# EAGLE design BMS Segment Jeff v2 (EAGLE 8.1.0)
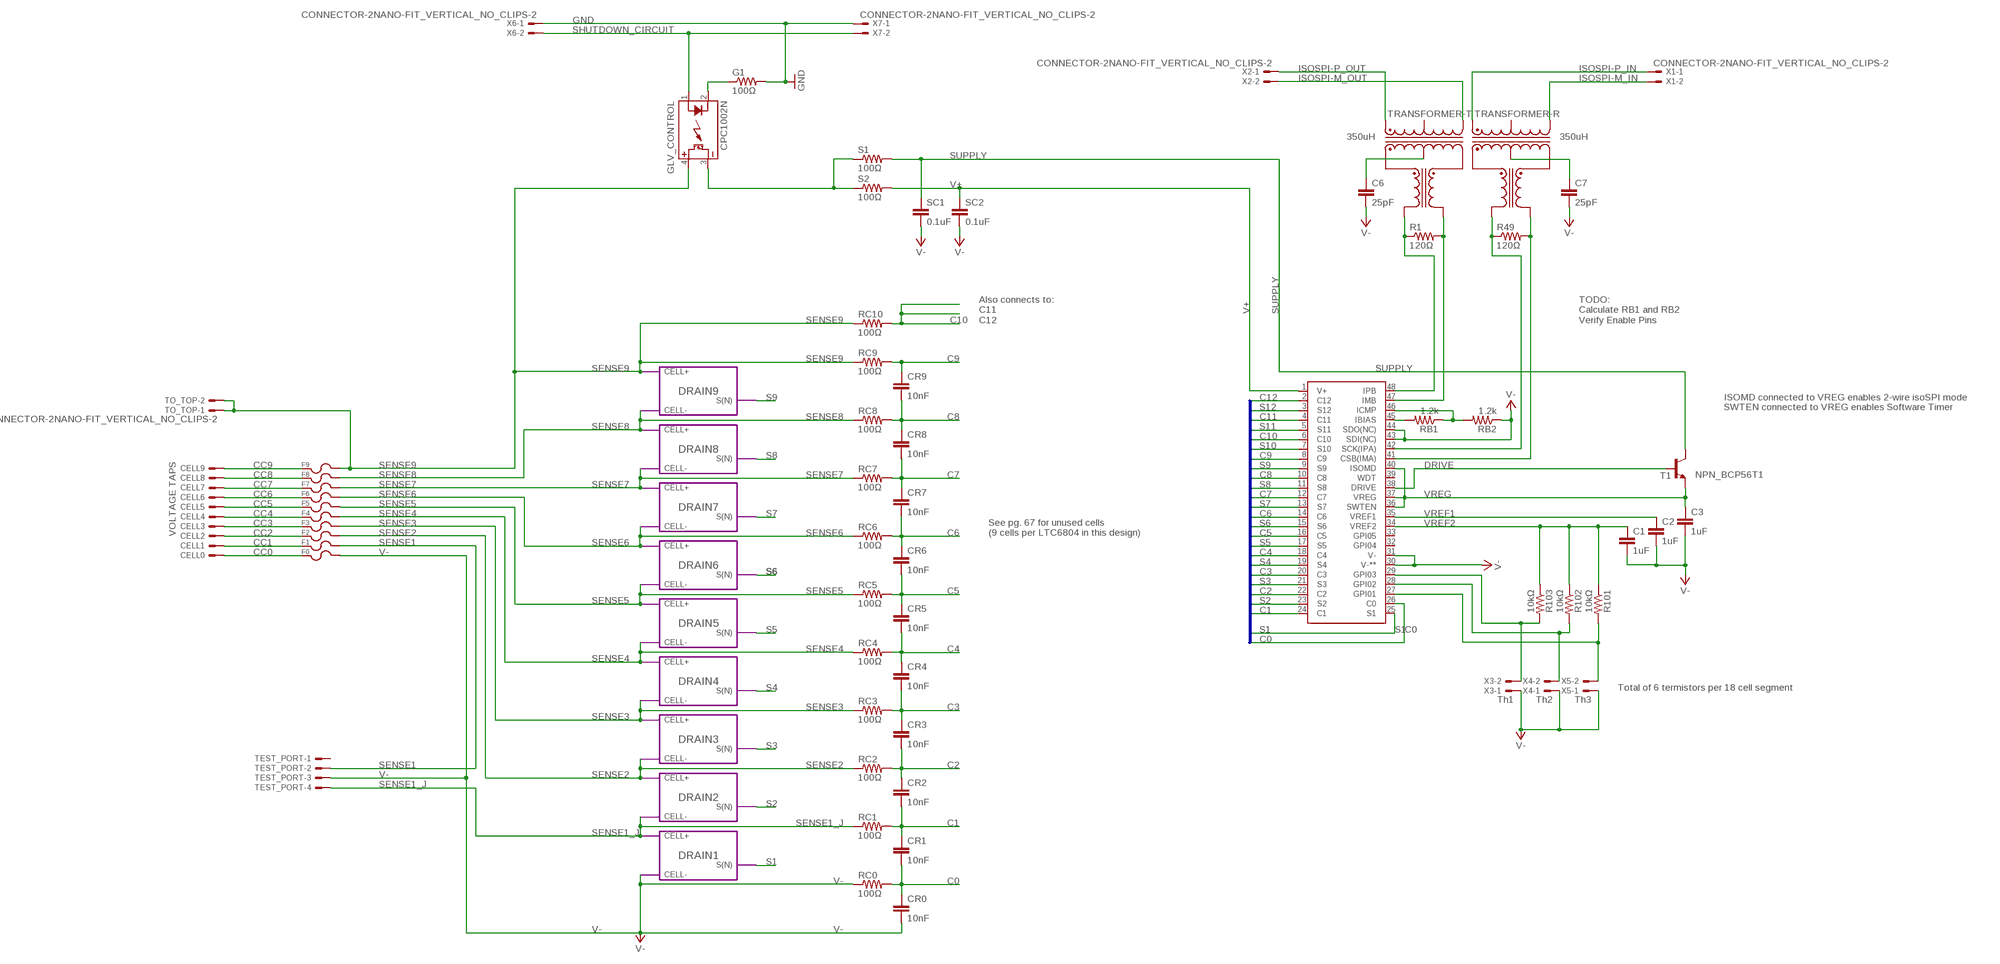
[diagram p0: schematic, sheet 1]

## Parts
C1  1uF  CAP0805  [0805]
C2  1uF  CAP0805  [0805]
C3  1uF  CAP0805  [0805]
C6  25pF  CAP0805  [0805]
C7  25pF  CAP0805  [0805]
CELL0  BATTERY_SPRING_KEYSTONE5222  [KEYSTONE5222]
CELL1  BATTERY_SPRING_KEYSTONE5222  [KEYSTONE5222]
CELL2  BATTERY_SPRING_KEYSTONE5222  [KEYSTONE5222]
CELL3  BATTERY_SPRING_KEYSTONE5222  [KEYSTONE5222]
CELL4  BATTERY_SPRING_KEYSTONE5222  [KEYSTONE5222]
CELL5  BATTERY_SPRING_KEYSTONE5222  [KEYSTONE5222]
CELL6  BATTERY_SPRING_KEYSTONE5222  [KEYSTONE5222]
CELL7  BATTERY_SPRING_KEYSTONE5222  [KEYSTONE5222]
CELL8  BATTERY_SPRING_KEYSTONE5222  [KEYSTONE5222]
CELL9  BATTERY_SPRING_KEYSTONE5222  [KEYSTONE5222]
CR0  10nF  CAP0805  [0805]
CR1  10nF  CAP0805  [0805]
CR2  10nF  CAP0805  [0805]
CR3  10nF  CAP0805  [0805]
CR4  10nF  CAP0805  [0805]
CR5  10nF  CAP0805  [0805]
CR6  10nF  CAP0805  [0805]
CR7  10nF  CAP0805  [0805]
CR8  10nF  CAP0805  [0805]
CR9  10nF  CAP0805  [0805]
F0  0751.0110_FUSE_CLIP  [0751.0110]
F1  0751.0110_FUSE_CLIP  [0751.0110]
F2  0751.0110_FUSE_CLIP  [0751.0110]
F3  0751.0110_FUSE_CLIP  [0751.0110]
F4  0751.0110_FUSE_CLIP  [0751.0110]
F5  0751.0110_FUSE_CLIP  [0751.0110]
F6  0751.0110_FUSE_CLIP  [0751.0110]
F7  0751.0110_FUSE_CLIP  [0751.0110]
F8  0751.0110_FUSE_CLIP  [0751.0110]
F9  0751.0110_FUSE_CLIP  [0751.0110]
G1  100Ω  RESISTOR0805-RES  [0805]
GLV_CONTROL  CPC1002N  [SOP04]
R1  120Ω  RESISTOR0805-RES  [0805]
R49  120Ω  RESISTOR0805-RES  [0805]
R101  10kΩ  RESISTOR0805-RES  [0805]
R102  10kΩ  RESISTOR0805-RES  [0805]
R103  10kΩ  RESISTOR0805-RES  [0805]
RB1  1.2k  RESISTOR0805-RES  [0805]
RB2  1.2k  RESISTOR0805-RES  [0805]
RC0  100Ω  RESISTOR0805-RES  [0805]
RC1  100Ω  RESISTOR0805-RES  [0805]
RC2  100Ω  RESISTOR0805-RES  [0805]
RC3  100Ω  RESISTOR0805-RES  [0805]
RC4  100Ω  RESISTOR0805-RES  [0805]
RC5  100Ω  RESISTOR0805-RES  [0805]
RC6  100Ω  RESISTOR0805-RES  [0805]
RC7  100Ω  RESISTOR0805-RES  [0805]
RC8  100Ω  RESISTOR0805-RES  [0805]
RC9  100Ω  RESISTOR0805-RES  [0805]
RC10  100Ω  RESISTOR0805-RES  [0805]
S1  100Ω  RESISTOR0805-RES  [0805]
S2  100Ω  RESISTOR0805-RES  [0805]
SC1  0.1uF  CAP0805  [0805]
SC2  0.1uF  CAP0805  [0805]
T1  NPN_BCP56T1  [SOT223]
TEST_PORT  MINIFIT_5566-4  [MINIFIT_5566-4]
TO_TOP  CONNECTOR-2NANO-FIT_VERTICAL_NO_CLIPS-2  [NANO-FIT_VERTICAL_NO_CLIPS-2]
TRANSFORMER-  350uH  TRANSFORMER_749010013  [749010013]
U$2  LTC6804-1  [LTC6804]
X1  CONNECTOR-2NANO-FIT_VERTICAL_NO_CLIPS-2  [NANO-FIT_VERTICAL_NO_CLIPS-2]
X2  CONNECTOR-2NANO-FIT_VERTICAL_NO_CLIPS-2  [NANO-FIT_VERTICAL_NO_CLIPS-2]
X3  Th1  CONNECTOR-2NANO-FIT_VERTICAL_NO_CLIPS-2  [NANO-FIT_VERTICAL_NO_CLIPS-2]
X4  Th2  CONNECTOR-2NANO-FIT_VERTICAL_NO_CLIPS-2  [NANO-FIT_VERTICAL_NO_CLIPS-2]
X5  Th3  CONNECTOR-2NANO-FIT_VERTICAL_NO_CLIPS-2  [NANO-FIT_VERTICAL_NO_CLIPS-2]
X6  CONNECTOR-2NANO-FIT_VERTICAL_NO_CLIPS-2  [NANO-FIT_VERTICAL_NO_CLIPS-2]
X7  CONNECTOR-2NANO-FIT_VERTICAL_NO_CLIPS-2  [NANO-FIT_VERTICAL_NO_CLIPS-2]

## Module instances
DRAIN1 = DRAIN
DRAIN2 = DRAIN
DRAIN3 = DRAIN
DRAIN4 = DRAIN
DRAIN5 = DRAIN
DRAIN6 = DRAIN
DRAIN7 = DRAIN
DRAIN8 = DRAIN
DRAIN9 = DRAIN

## Nets
C0: CR0.1 CR1.2 RC0.2 U$2.26(C0)
C1: CR1.1 CR2.2 RC1.2 U$2.24(C1)
C2: CR2.1 CR3.2 RC2.2 U$2.22(C2)
C3: CR3.1 CR4.2 RC3.2 U$2.20(C3)
C4: CR4.1 CR5.2 RC4.2 U$2.18(C4)
C5: CR5.1 CR6.2 RC5.2 U$2.16(C5)
C6: CR6.1 CR7.2 RC6.2 U$2.14(C6)
C7: CR7.1 CR8.2 RC7.2 U$2.12(C7)
C8: CR8.1 CR9.2 RC8.2 U$2.10(C8)
C9: CR9.1 RC9.2 U$2.8(C9)
C10: RC10.2 U$2.6(C10)
C11: U$2.4(C11)
C12: U$2.2(C12)
CC0: CELL0.P$1(S) F0.L1 F0.L2
CC1: CELL1.P$1(S) F1.L1 F1.L2
CC2: CELL2.P$1(S) F2.L1 F2.L2
CC3: CELL3.P$1(S) F3.L1 F3.L2
CC4: CELL4.P$1(S) F4.L1 F4.L2
CC5: CELL5.P$1(S) F5.L1 F5.L2
CC6: CELL6.P$1(S) F6.L1 F6.L2
CC7: CELL7.P$1(S) F7.L1 F7.L2
CC8: CELL8.P$1(S) F8.L1 F8.L2
CC9: CELL9.P$1(S) F9.L1 F9.L2
DRIVE: T1.1(BASE) U$2.38(DRIVE)
GND: G1.2 X6.P$1 X7.P$1
ISOSPI-M_IN: TRANSFORMER-.8(R:D-) X1.P$2
ISOSPI-M_OUT: TRANSFORMER-.3(T:D-) X2.P$2
ISOSPI-P_IN: TRANSFORMER-.6(R:D+) X1.P$1
ISOSPI-P_OUT: TRANSFORMER-.1(T:D+) X2.P$1
N$1: C7.1 TRANSFORMER-.10(R:CX)
N$2: C6.1 TRANSFORMER-.15(T:CX)
N$4: RB1.2 U$2.45(IBIAS)
N$5: R1.1 TRANSFORMER-.16(T:X+) U$2.48(IPB)
N$7: RB1.1 RB2.2 U$2.46(ICMP)
N$8: R49.1 TRANSFORMER-.11(R:X+) U$2.42(SCK(IPA))
N$9: R49.2 TRANSFORMER-.9(R:X-) U$2.41(CSB(IMA))
N$42: R1.2 TRANSFORMER-.14(T:X-) U$2.47(IMB)
S1: U$2.25(S1) ; port DRAIN1.S(N)
S2: U$2.23(S2) ; port DRAIN2.S(N)
S3: U$2.21(S3) ; port DRAIN3.S(N)
S4: U$2.19(S4) ; port DRAIN4.S(N)
S5: U$2.17(S5) ; port DRAIN5.S(N)
S6: U$2.15(S6) ; port DRAIN6.S(N)
S7: U$2.13(S7) ; port DRAIN7.S(N)
S8: U$2.11(S8) ; port DRAIN8.S(N)
S9: U$2.9(S9) ; port DRAIN9.S(N)
S10: U$2.7(S10)
S11: U$2.5(S11)
S12: U$2.3(S12)
SENSE1: F1.R1 F1.R2 TEST_PORT.2
SENSE1_J: RC1.1 TEST_PORT.4 ; port DRAIN1.CELL+ DRAIN2.CELL-
SENSE2: F2.R1 F2.R2 RC2.1 ; port DRAIN2.CELL+ DRAIN3.CELL-
SENSE3: F3.R1 F3.R2 RC3.1 ; port DRAIN3.CELL+ DRAIN4.CELL-
SENSE4: F4.R1 F4.R2 RC4.1 ; port DRAIN4.CELL+ DRAIN5.CELL-
SENSE5: F5.R1 F5.R2 RC5.1 ; port DRAIN5.CELL+ DRAIN6.CELL-
SENSE6: F6.R1 F6.R2 RC6.1 ; port DRAIN6.CELL+ DRAIN7.CELL-
SENSE7: F7.R1 F7.R2 RC7.1 ; port DRAIN7.CELL+ DRAIN8.CELL-
SENSE8: F8.R1 F8.R2 RC8.1 ; port DRAIN8.CELL+ DRAIN9.CELL-
SENSE9: F9.R1 F9.R2 GLV_CONTROL.4(DC+) RC9.1 RC10.1 TO_TOP.P$1 TO_TOP.P$2 ; port DRAIN9.CELL+
SHUTDOWN_CIRCUIT: GLV_CONTROL.1(CONTROL+) X6.P$2 X7.P$2
SSR-: G1.1 GLV_CONTROL.2(CONTROL-)
SUPPLY: S1.2 SC1.1 T1.2(COLLECTOR) T1.4(COLLECTOR)
SUPPLY_INTER: GLV_CONTROL.3(DC-) S1.1 S2.1
THERMISTOR1: R101.2 U$2.27(GPI01) X5.P$2
THERMISTOR2: R102.2 U$2.28(GPI02) X4.P$2
THERMISTOR3: R103.2 U$2.29(GPI03) X3.P$2
V+: S2.2 SC2.1 U$2.1(V+)
V-: C1.2 C2.2 C3.2 C6.2 C7.2 CR0.2 F0.R1 F0.R2 RB2.1 RC0.1 SC1.2 SC2.2 TEST_PORT.3 U$2.30(V-**) U$2.31(V-) U$2.43(SDI(NC)) U$2.44(SDO(NC)) X3.P$1 X4.P$1 X5.P$1 ; port DRAIN1.CELL-
VREF1: C2.1 U$2.35(VREF1)
VREF2: C1.1 R101.1 R102.1 R103.1 U$2.34(VREF2)
VREG: C3.1 T1.3(EMITTER) U$2.36(SWTEN) U$2.37(VREG) U$2.40(ISOMD)
Unconnected: TEST_PORT.1 TRANSFORMER-.2(T:CD) TRANSFORMER-.7(R:CD) U$2.32(GPI04) U$2.33(GPI05) U$2.39(WDT)

## Buses
C[0..12],S[1..12]

## Notes on the sheet
- Also connects to:
  C11
  C12
- TODO:
  Calculate RB1 and RB2
  Verify Enable Pins
- ISOMD connected to VREG enables 2-wire isoSPI mode
- SWTEN connected to VREG enables Software Timer
- VOLTAGE TAPS
- See pg. 67 for unused cells
  (9 cells per LTC6804 in this design)
- Total of 6 termistors per 18 cell segment

## Library data of the parts
C1-C3 C6 C7 CR0 CR1-CR9 SC1 SC2 = HyTechDevices:CAP: Capacitor Standard 0603 ceramic capacitor, and 0.1" leaded capacitor.
CELL0 CELL1-CELL9 = HyTechDevices:BATTERY_SPRING
F0 F1-F9 = HyTechDevices:0751.0110_FUSE_CLIP: Schurter 0751.0110 Brass Fuse Clip Datasheet <http://www.mouser.com/ds/2/358/typ_OG__Clip__5x20-2553.pdf>
G1 R1 R49 R101-R103 RB1 RB2 RC0 RC1-RC10 S1 S2 = HyTechDevices:RESISTOR: Resistor Basic schematic elements and footprints for 0603, 1206, and PTH resistors.
GLV_CONTROL = HyTechDevices:CPC1002N: IXYS Solid State Relay .7A
T1 = HyTechDevices:NPN_BCP56T1: ON Semiconductor BCP56 Series NPN Silicon Epitaxial Transistor Datasheet <http://www.mouser.com/ds/2/308/BCP56T1-D-104805.pdf>
TEST_PORT = HyTechDevices:MINIFIT_5566-4: Mini-Fit Junior connector 4 pole Source: http://www.molex.com; OC_FARNELL: unknown; OC_NEWARK: unknown
TO_TOP X1-X7 = HyTechDevices:CONNECTOR-2: Mini-Fit Junior connector 2 pole Source: http://www.molex.com
TRANSFORMER- = HyTechDevices:TRANSFORMER_749010013: Wurth Electronics Midcom 749010013 10/100BaseTX Ethernet Transformer Datasheet <http://www.mouser.com/ds/2/445/749010013-311000.pdf> Mouser Page <http://www.mouser.com/ProductDetail/Wurth-Electronics-Midcom/749010013/?qs=40TFAHZMFvcjCZphxWYgVw%3D%3D>
U$2 = HyTechDevices:LTC6804-1: Linear Technology LTC6804-1 Multicell Battery Monitor Datasheet <http://cds.linear.com/docs/en/datasheet/680412fc.pdf>

## Module DRAIN
Ports: CELL+(in) CELL-(out) S(N)(io)
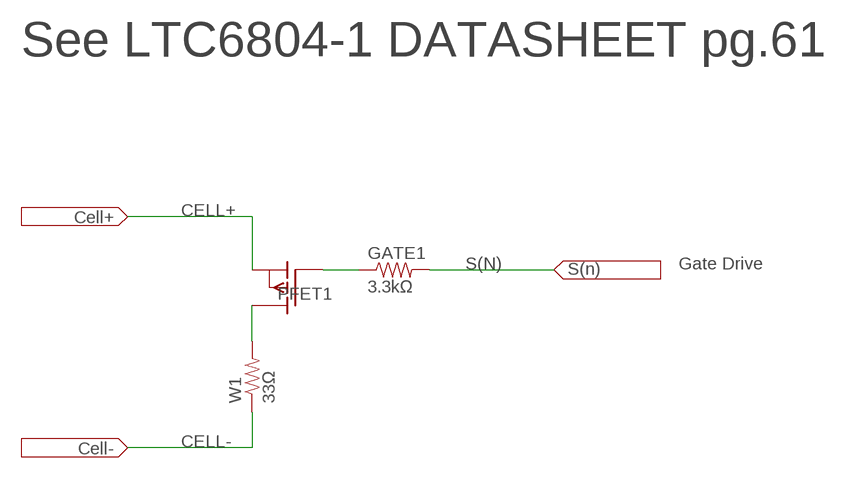
[diagram p1: schematic, module DRAIN, sheet 1]

### Parts
GATE1  3.3kΩ  RESISTOR0805-RES  [0805]
PFET1  P-CHANNEL_MOSFET_DMP3099L-7  [SOT23]
W1  33Ω  RESISTOR2512  [R2512]

### Nets
CELL+: PFET1.2(S)
CELL-: W1.1
DRAIN: PFET1.3(D) W1.2
GATE: GATE1.1 PFET1.1(G)
S(N): GATE1.2

### Notes on the sheet
- See LTC6804-1 DATASHEET pg.61
- Gate Drive

### Library data of the parts
GATE1 W1 = HyTechDevices:RESISTOR: Resistor Basic schematic elements and footprints for 0603, 1206, and PTH resistors.
PFET1 = HyTechDevices:P-CHANNEL_MOSFET_DMP3099L-7: Diodes Incorporated P-Channel Enhancement Mode MOSFET Datasheet <http://www.mouser.com/ds/2/115/DMP3099L-266220.pdf>

## Board
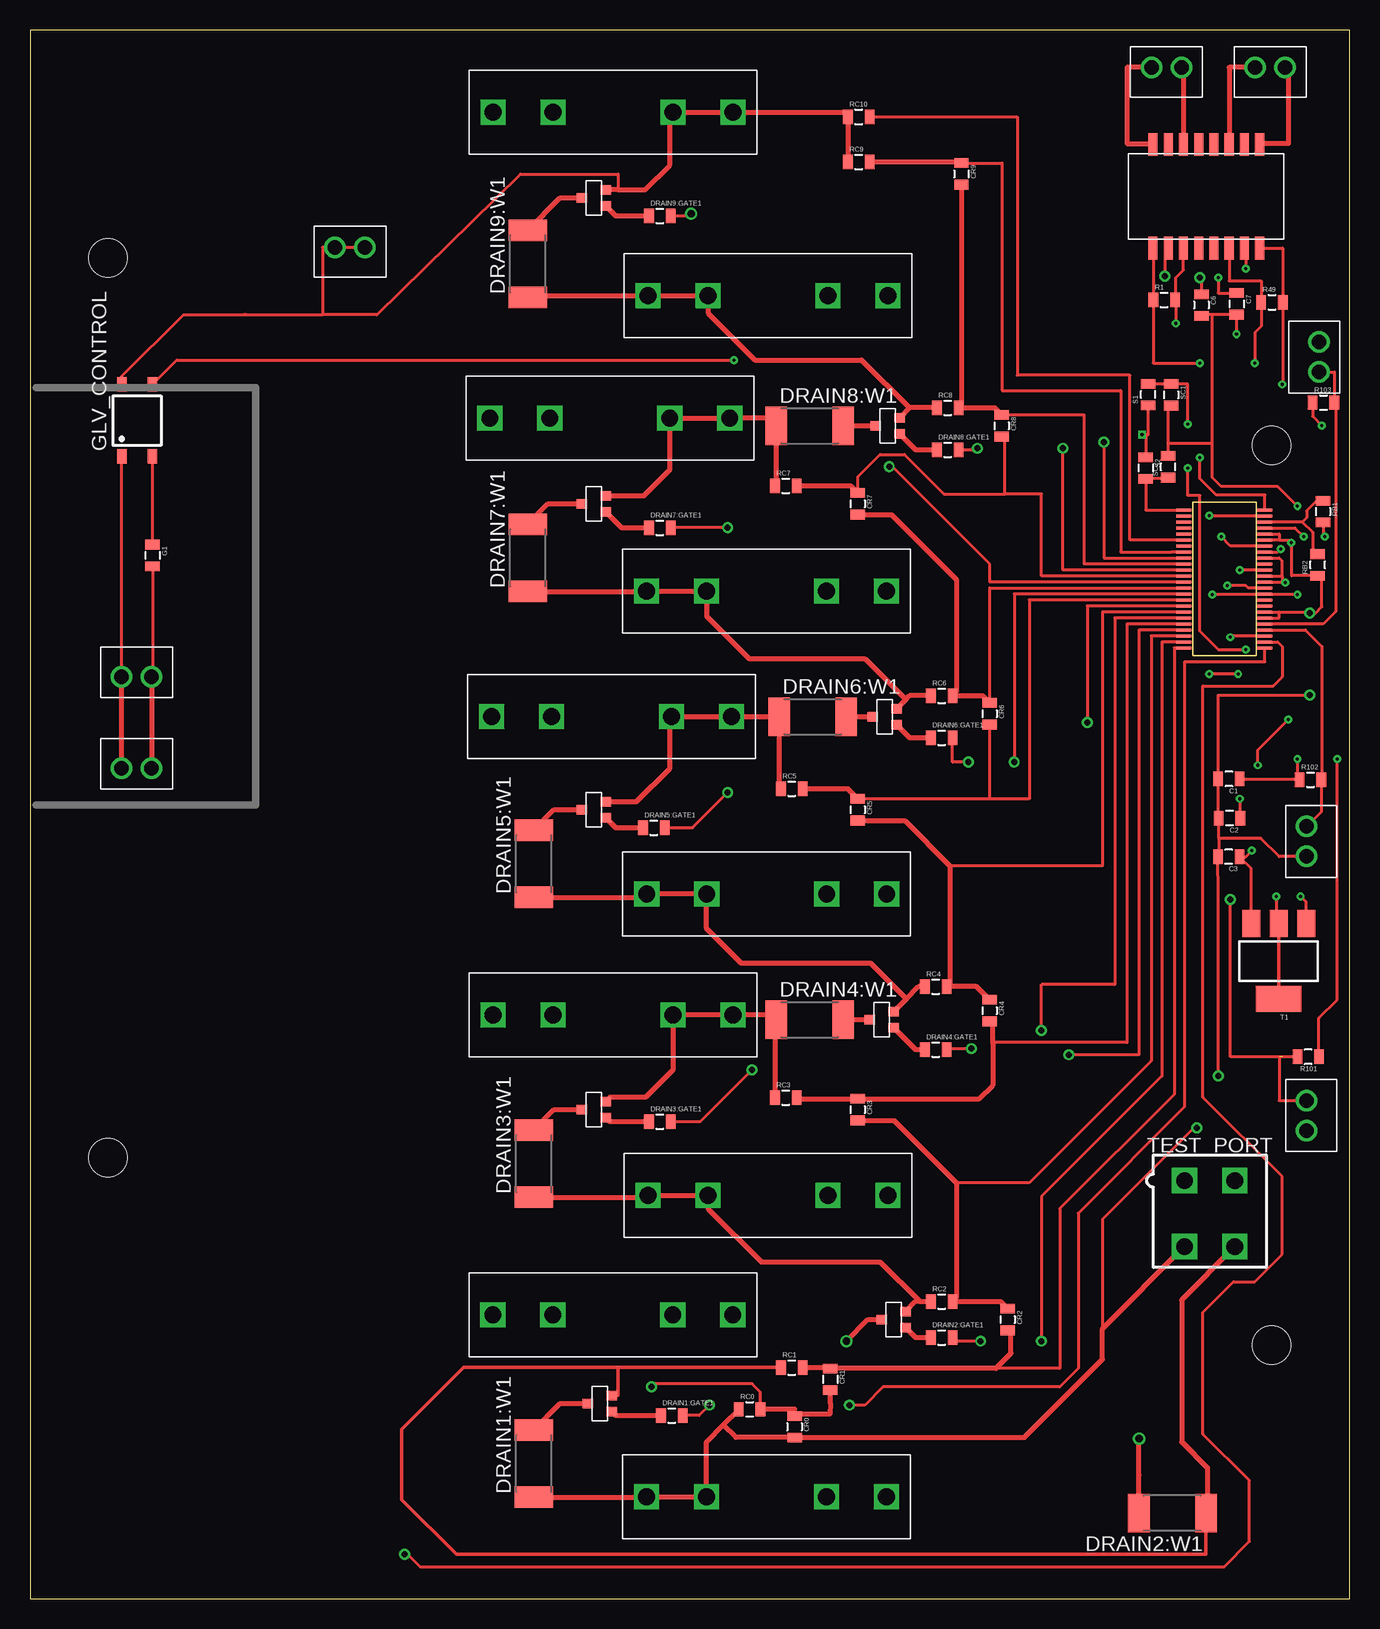
[diagram p2: board, top side]
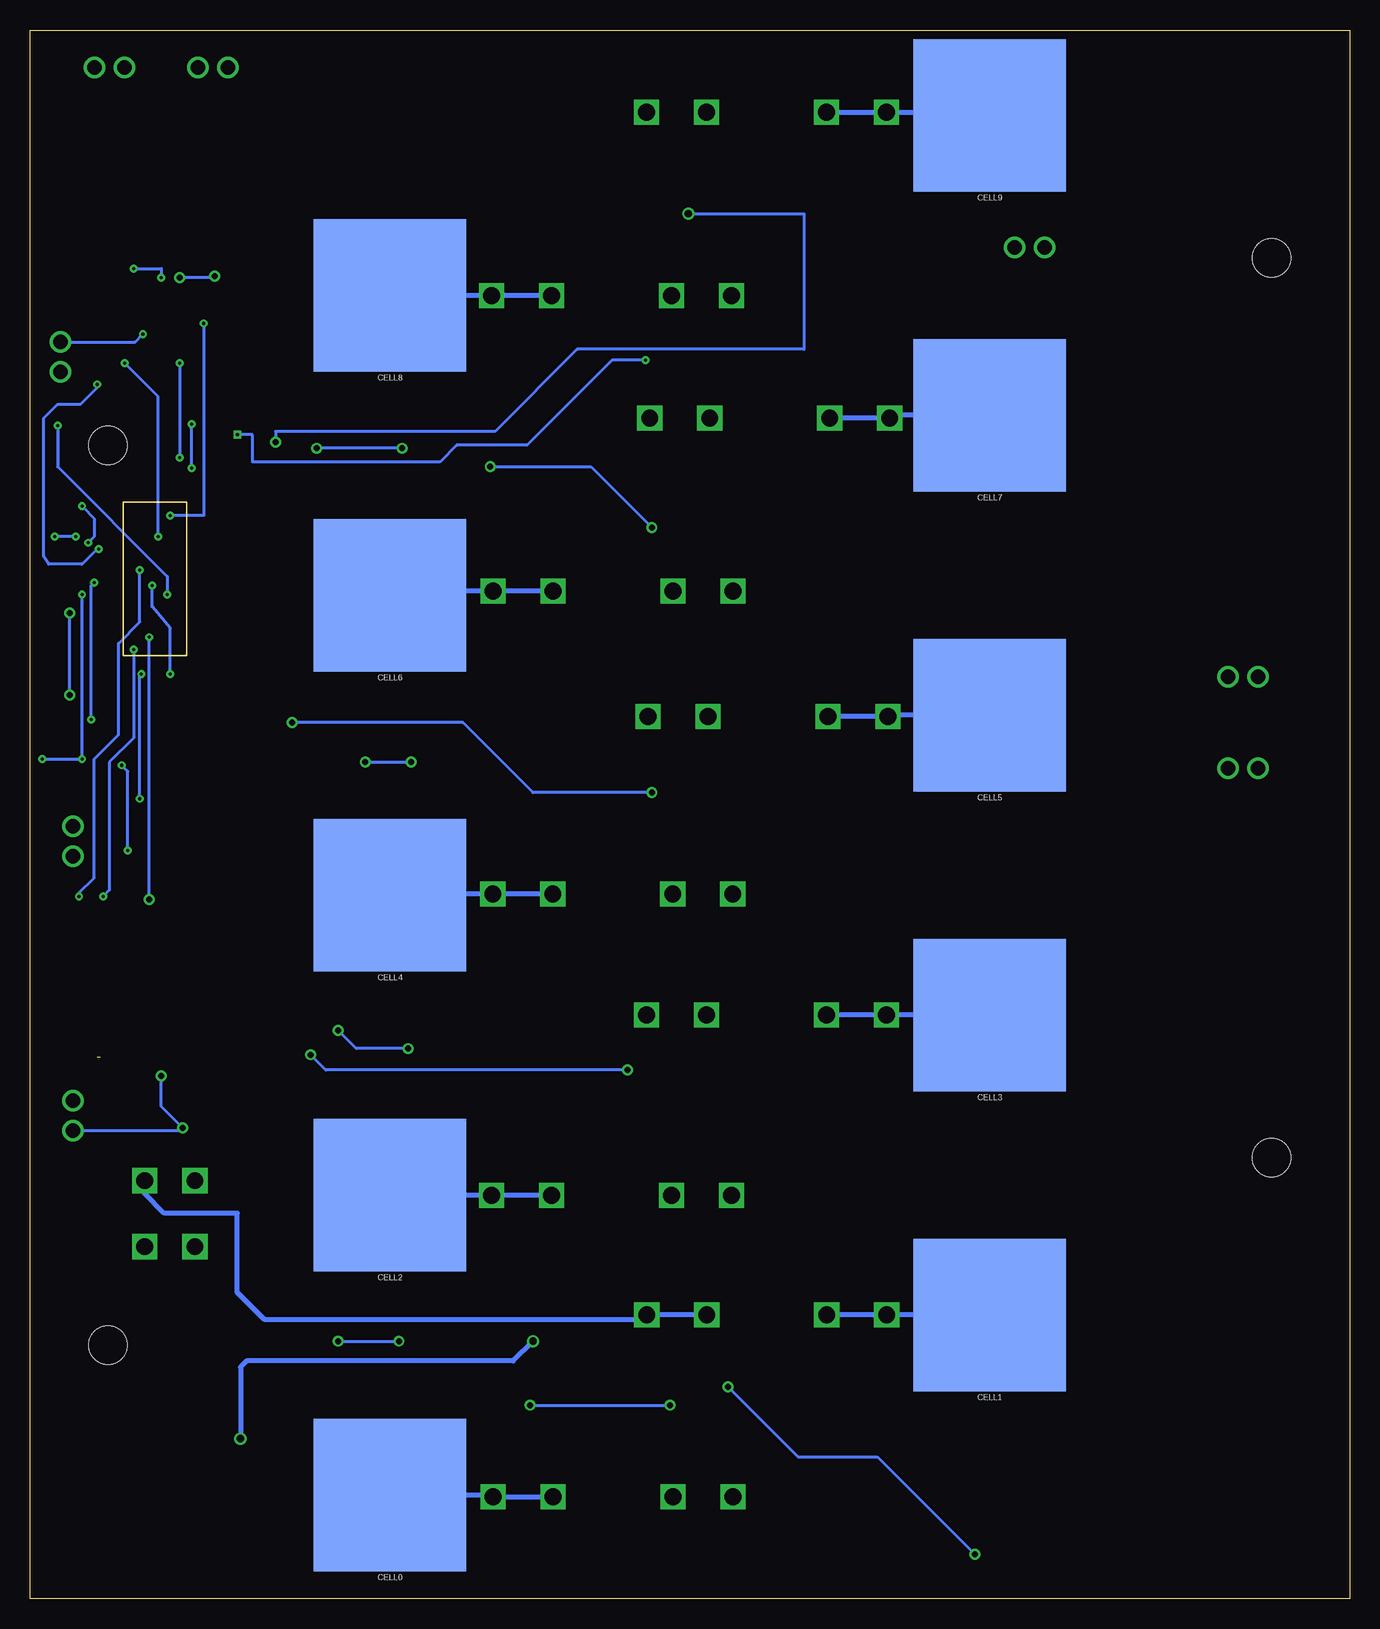
[diagram p3: board, bottom side, seen from below]

Size 110 x 130.76 mm. Coordinates in mm from the lower left corner, seen from the top.
Outline: 0,0 110,0 110,130.76 0,130.76 0,0
Copper layers (1*16): Top 0.035mm / dielectric 1.5mm / Bottom 0.035mm
Design rules "default": minimum track width 10mil, minimum drill 24mil, track to track 8mil, track to pad 8mil, pad to pad 8mil, via to via 8mil, smd to smd 8mil, copper to edge 40mil, drill to drill 8mil, minimum pad ring 10mil, minimum via ring 8mil, stop-mask expansion 4mil, vias tented up to drill 0mil, thermal gap 10mil
Holes 3.2 mm at 6.5,36.77 6.5,111.77 103.5,96.15 103.5,21.15

### Footprints (pad centres in the part's own frame; a part is rotated, then mirrored left to right if it is on the bottom)
0805 = smd 0.8 x 1.2: 1 -0.9,0; 2 0.9,0
KEYSTONE5222 = smd 12.7 x 12.7: P$1 0,0
SOT23 = smd 0.8 x 0.9: 1 -0.675,-1; 2 0.675,-1; 3 0,1
R2512 = smd 1.8 x 3.2: 1 -2.8,0; 2 2.8,0
0751.0110 = drill 1.4 square: L1 -10,0; L2 -5,0; R1 5,0; R2 10,0
SOP04 = smd 0.8 x 1.2: 1 -1.27,-3; 2 1.27,-3; 3 1.27,3; 4 -1.27,3
SOT223 = smd 1.5 x 2.235: 1 -2.3,-3.15; 2 0,-3.15; 3 2.3,-3.15 | smd 3.8 x 2.2: 4 0,3.15
MINIFIT_5566-4 = drill 1.4 square: 1 2.1,-2.75; 2 -2.1,-2.75; 3 2.1,2.75; 4 -2.1,2.75
NANO-FIT_VERTICAL_NO_CLIPS-2 = drill 1.2: P$1 -1.25,0; P$2 1.25,0
749010013 = smd 1.905 x 0.762: 1 4.318,4.445; 2 4.318,3.175; 3 4.318,1.905; 4 4.318,0.635; 5 4.318,-0.635; 6 4.318,-1.905; 7 4.318,-3.175; 8 4.318,-4.445; 9 -4.318,-4.445; 10 -4.318,-3.175; 11 -4.318,-1.905; 12 -4.318,-0.635; 13 -4.318,0.635; 14 -4.318,1.905; 15 -4.318,3.175; 16 -4.318,4.445
LTC6804 = smd 0.25 x 1.25: 1 -5.75,-3.375; 2 -5.25,-3.375; 3 -4.75,-3.375; 4 -4.25,-3.375; 5 -3.75,-3.375; 6 -3.25,-3.375; 7 -2.75,-3.375; 8 -2.25,-3.375; 9 -1.75,-3.375; 10 -1.25,-3.375; 11 -0.75,-3.375; 12 -0.25,-3.375; 13 0.25,-3.375; 14 0.75,-3.375; 15 1.25,-3.375; 16 1.75,-3.375; 17 2.25,-3.375; 18 2.75,-3.375; 19 3.25,-3.375; 20 3.75,-3.375; 21 4.25,-3.375; 22 4.75,-3.375; 23 5.25,-3.375; 24 5.75,-3.375; 25 5.75,3.375; 26 5.25,3.375; 27 4.75,3.375; 28 4.25,3.375; 29 3.75,3.375; 30 3.25,3.375; 31 2.75,3.375; 32 2.25,3.375; 33 1.75,3.375; 34 1.25,3.375; 35 0.75,3.375; 36 0.25,3.375; 37 -0.25,3.375; 38 -0.75,3.375; 39 -1.25,3.375; 40 -1.75,3.375; 41 -2.25,3.375; 42 -2.75,3.375; 43 -3.25,3.375; 44 -3.75,3.375; 45 -4.25,3.375; 46 -4.75,3.375; 47 -5.25,3.375; 48 -5.75,3.375

### Placement (x,y rotation side)
C1  99.95,68.33 180 top
C2  100,65.06 180 top
C3  99.93,61.84 180 top
C6  97.65,107.84 270 top
C7  100.59,107.93 270 top
CELL0  80,8.65 0 bottom
CELL1  30,23.65 0 bottom
CELL2  80,33.65 0 bottom
CELL3  30,48.65 0 bottom
CELL4  80,58.65 0 bottom
CELL5  30,73.65 0 bottom
CELL6  80,83.65 0 bottom
CELL7  30,98.65 0 bottom
CELL8  80,108.65 0 bottom
CELL9  30,123.65 0 bottom
CR0  63.73,14.33 270 top
CR1  66.71,18.29 270 top
CR2  81.5,23.26 270 top
CR3  69,40.76 270 top
CR4  80,49.01 270 top
CR5  69,65.76 270 top
CR6  80,73.76 270 top
CR7  69,91.26 270 top
CR8  81,97.76 270 top
CR9  77.64,118.77 270 top
DRAIN1:GATE1  3.3kΩ  [0805]  53.5,15.26 0 top
DRAIN1:PFET1  P-CHANNEL_MOSFET_DMP3099L-7  [SOT23]  47.5,16.26 90 top
DRAIN1:W1  33Ω  [R2512]  42,11.26 90 top
DRAIN2:GATE1  3.3kΩ  [0805]  76,21.76 0 top
DRAIN2:PFET1  P-CHANNEL_MOSFET_DMP3099L-7  [SOT23]  72,23.26 90 top
DRAIN2:W1  33Ω  [R2512]  95.24,7.13 180 top
DRAIN3:GATE1  3.3kΩ  [0805]  52.5,39.76 0 top
DRAIN3:PFET1  P-CHANNEL_MOSFET_DMP3099L-7  [SOT23]  47,40.76 90 top
DRAIN3:W1  33Ω  [R2512]  42,36.26 90 top
DRAIN4:GATE1  3.3kΩ  [0805]  75.5,45.76 0 top
DRAIN4:PFET1  P-CHANNEL_MOSFET_DMP3099L-7  [SOT23]  71,48.26 90 top
DRAIN4:W1  33Ω  [R2512]  65,48.26 0 top
DRAIN5:GATE1  3.3kΩ  [0805]  52,64.26 0 top
DRAIN5:PFET1  P-CHANNEL_MOSFET_DMP3099L-7  [SOT23]  47,65.76 90 top
DRAIN5:W1  33Ω  [R2512]  42,61.26 90 top
DRAIN6:GATE1  3.3kΩ  [0805]  76,71.76 0 top
DRAIN6:PFET1  P-CHANNEL_MOSFET_DMP3099L-7  [SOT23]  71.25,73.51 90 top
DRAIN6:W1  33Ω  [R2512]  65.25,73.51 0 top
DRAIN7:GATE1  3.3kΩ  [0805]  52.5,89.26 0 top
DRAIN7:PFET1  P-CHANNEL_MOSFET_DMP3099L-7  [SOT23]  47,91.26 90 top
DRAIN7:W1  33Ω  [R2512]  41.5,86.76 90 top
DRAIN8:GATE1  3.3kΩ  [0805]  76.5,95.76 0 top
DRAIN8:PFET1  P-CHANNEL_MOSFET_DMP3099L-7  [SOT23]  71.5,97.76 90 top
DRAIN8:W1  33Ω  [R2512]  65,97.76 0 top
DRAIN9:GATE1  3.3kΩ  [0805]  52.5,115.26 0 top
DRAIN9:PFET1  P-CHANNEL_MOSFET_DMP3099L-7  [SOT23]  47,116.76 90 top
DRAIN9:W1  33Ω  [R2512]  41.5,111.26 90 top
F0  61.4,8.5 180 top
F1  48.59,23.65 0 top
F2  61.53,33.62 180 top
F3  48.6,48.65 0 top
F4  61.41,58.74 180 top
F5  48.47,73.53 0 top
F6  61.4,83.99 180 top
F7  48.34,98.41 0 top
F8  61.53,108.61 180 top
F9  48.6,123.91 0 top
G1  10.22,86.97 270 top
GLV_CONTROL  8.92,98.2 0 top
R1  94.54,108.26 0 top
R49  103.53,108.07 0 top
R101  106.55,45.17 180 top
R102  106.75,68.26 0 top
R103  107.83,99.7 0 top
RB1  107.79,90.62 270 top
RB2  107.35,86.17 90 top
RC0  59.99,15.79 0 top
RC1  63.5,19.26 0 top
RC2  76,24.76 0 top
RC3  63,41.76 0 top
RC4  75.5,51.01 0 top
RC5  63.5,67.51 0 top
RC6  76,75.26 0 top
RC7  63,92.76 0 top
RC8  76.5,99.26 0 top
RC9  69.09,119.76 0 top
RC10  69.09,123.52 0 top
S1  93.21,100.38 90 top
S2  93.02,94.25 270 top
SC1  95.13,100.35 270 top
SC2  94.88,94.35 90 top
T1  104.09,53.14 180 top
TEST_PORT  98.35,32.1 180 top
TO_TOP  26.67,112.65 0 top
TRANSFORMER-  98.06,116.9 90 top
U$2  99.58,85 270 top
X1  103.38,127.64 0 top
X2  94.74,127.64 0 top
X3  107.44,103.51 270 top
X4  106.43,63.12 90 top
X5  106.43,40.26 90 top
X6  8.89,76.84 180 top
X7  8.89,69.22 180 top

### Tracks (layer width: path | path; a pad name or v marks a point on that pad's centre or on a via)
C0  (via drill 0.5 pad 0.13)
  Top 0.254: RC0.2 60.89,17.22 60.2,17.91 52.07,17.91 v51.82,17.66 | v31.24,3.69 31.5,3.69 32.51,2.67 99.57,2.67 101.66,4.77 101.66,9.85 97.79,13.72 97.79,23.88 100.33,26.42 102.11,26.42 104.39,28.71 104.39,35.18 97.79,41.79 97.79,76.08 103.63,76.08 104.39,76.84 104.39,79.38 104.02,79.75 U$2.26
  Top 0.406: RC0.2 63.73,15.79 CR0.1 63.62,15.37 66.67,15.37 66.71,16.3 CR1.2
  Bottom 0.254: v51.82,17.66 45.97,11.81 39.37,11.81 v31.24,3.69
C1
  Top 0.254: U$2.24 95.38,79.25 95.38,42.04 85.85,32.52 85.85,19.18 80.52,19.18 80.52,19.19
  Top 0.406: RC1.2 66.13,19.26 CR1.1 80.52,19.19 81.79,20.45 81.79,22.07 CR2.2
C2
  Top 0.254: U$2.22 93.47,80.25 93.47,44.83 83.31,34.67 77.22,34.67
  Top 0.406: CR3.2 72.03,39.86 77.22,34.67 77.22,25.08 RC2.2 80.9,24.76 CR2.1
C3
  Top 0.254: U$2.20 91.44,81.25 91.44,46.36 80.26,46.36
  Top 0.406: RC3.2 64,41.66 CR3.1 79.12,41.66 80.26,42.8 80.26,46.36 80.26,47.85 CR4.2
C4
  Top 0.254: U$2.18 89.41,82.25 89.41,61.09 76.71,61.09
  Top 0.406: CR5.2 72.94,64.86 76.71,61.09 76.71,51.32 RC4.2 78.9,51.01 CR4.1
C5
  Top 0.254: 80,72.77 CR6.2 80.01,66.68 | 80.01,66.68 78.98,66.66 CR5.1 | 80.01,66.68 83.31,66.68 83.31,83.25 U$2.16
  Top 0.406: RC5.2 68.15,67.51 CR5.1
C6
  Top 0.254: U$2.14 80,84.25 CR6.1
  Top 0.406: CR7.2 71.82,90.36 77.22,84.97 77.22,75.58 RC6.2 79.4,75.26 CR6.1
C7
  Top 0.254: 81,96.65 CR8.2 | 81.28,92.08 81.28,96.58 | U$2.12 84.33,85.25 84.33,92.08 81.28,92.08 | CR7.1 69,93.51 70.87,95.38 72.9,95.38 76.2,92.08 81.28,92.08
  Top 0.406: RC7.2 68.4,92.76 CR7.1 | 81.28,96.58 CR8.2
C8
  Top 0.254: CR8.1 87.88,98.66 87.88,86.25 U$2.10
  Top 0.406: CR8.1 80.4,99.26 RC8.2 77.64,99.51 CR9.2
C9
  Top 0.254: U$2.8 95.19,87.25 90.93,87.25 90.93,100.71 81.03,100.71 81.03,119.67 CR9.1
  Top 0.406: RC9.2 77.55,119.76 CR9.1
C10
  Top 0.254: 70.04,123.57 RC10.2 82.3,123.52 82.3,101.98 91.69,101.98 91.69,88.25 U$2.6
CC0
  Bottom 0.406: CELL0.P$1 71.55,8.65 F0.L1 F0.L2
CC1
  Bottom 0.406: CELL1.P$1 F1.L1 F1.L2
CC2
  Bottom 0.406: F2.L2 F2.L1 | F2.L1 72.1,33.62 72.14,33.66 71.57,33.66 F2.L1 | F2.L1 79.97,33.62 CELL2.P$1
CC3
  Bottom 0.406: CELL3.P$1 F3.L1 F3.L2
CC4
  Bottom 0.406: F4.L2 F4.L1 79.91,58.74 CELL4.P$1
CC5
  Bottom 0.406: CELL5.P$1 38.35,73.65 F5.L1 F5.L2
CC6
  Bottom 0.406: F6.L2 F6.L1 79.66,83.99 CELL6.P$1
CC7
  Bottom 0.406: CELL7.P$1 38.1,98.65 F7.L1 F7.L2
CC8
  Bottom 0.406: F8.L2 F8.L1 79.97,108.61 CELL8.P$1
CC9
  Bottom 0.406: F9.L2 F9.L1 30.26,123.91 CELL9.P$1
DRAIN1:DRAIN
  Top 0.406: DRAIN1:W1.2 44.2,16.26 DRAIN1:PFET1.3
DRAIN1:GATE
  Top 0.406: DRAIN1:PFET1.1 48.83,15.26 DRAIN1:GATE1.1
DRAIN2:DRAIN  (via drill 0.6)
  Top 0.406: DRAIN2:W1.2 92.44,10.31 v92.46,13.34 | v68.07,21.47 69.87,23.26 DRAIN2:PFET1.3
  Bottom 0.406: v68.07,21.47 69.72,19.82 91.95,19.82 92.46,19.31 v92.46,13.34
DRAIN2:GATE
  Top 0.406: DRAIN2:PFET1.1 73.83,21.76 DRAIN2:GATE1.1
DRAIN3:DRAIN
  Top 0.406: DRAIN3:W1.2 43.7,40.76 DRAIN3:PFET1.3
DRAIN3:GATE
  Top 0.406: DRAIN3:PFET1.1 48.33,39.76 DRAIN3:GATE1.1
DRAIN4:DRAIN
  Top 0.406: DRAIN4:W1.2 DRAIN4:PFET1.3
DRAIN4:GATE
  Top 0.406: DRAIN4:PFET1.1 73.83,45.76 DRAIN4:GATE1.1
DRAIN5:DRAIN
  Top 0.406: DRAIN5:W1.2 43.7,65.76 DRAIN5:PFET1.3
DRAIN5:GATE
  Top 0.406: DRAIN5:PFET1.1 48.83,64.26 DRAIN5:GATE1.1
DRAIN6:DRAIN
  Top 0.406: DRAIN6:W1.2 DRAIN6:PFET1.3
DRAIN6:GATE
  Top 0.406: DRAIN6:PFET1.1 73.33,71.76 DRAIN6:GATE1.1
DRAIN7:DRAIN
  Top 0.406: DRAIN7:W1.2 43.2,91.26 DRAIN7:PFET1.3
DRAIN7:GATE
  Top 0.406: DRAIN7:PFET1.1 49.33,89.26 DRAIN7:GATE1.1
DRAIN8:DRAIN
  Top 0.406: DRAIN8:W1.2 DRAIN8:PFET1.3
DRAIN8:GATE
  Top 0.406: DRAIN8:PFET1.1 73.83,95.76 DRAIN8:GATE1.1
DRAIN9:DRAIN
  Top 0.406: DRAIN9:W1.2 44.2,116.76 DRAIN9:PFET1.3
DRAIN9:GATE
  Top 0.406: DRAIN9:PFET1.1 48.83,115.26 DRAIN9:GATE1.1
DRIVE  (via drill 0.25 pad 0.13)
  Top 0.254: T1.1 106.39,58.08 v105.92,58.55 | U$2.38 100.86,85.75 v100.84,85.73
  Bottom 0.254: v105.92,58.55 105.92,58.8 104.65,60.07 104.65,69.98 102.62,72.01 102.62,79.63 100.84,81.41 v100.84,85.73
GND
  Top 0.254: G1.2 10.22,76.92 X6.P$1
  Top 0.406: X6.P$1 X7.P$1
ISOSPI-M_IN
  Top 0.406: TRANSFORMER-.8 102.5,121.29 104.9,121.29 104.9,127.64 X1.P$2
ISOSPI-M_OUT
  Top 0.406: X2.P$2 96.15,127.64 TRANSFORMER-.3
ISOSPI-P_IN
  Top 0.406: X1.P$1 99.96,127.64 TRANSFORMER-.6
ISOSPI-P_OUT
  Top 0.406: TRANSFORMER-.1 93.61,121.29 91.44,121.29 91.44,127.64 X2.P$1
N$1  (via drill 0.25 pad 0.13)
  Top 0.254: TRANSFORMER-.10 101.35,112.58 v101.35,110.87 | v99.06,110.11 99.06,108.83 C7.1
  Bottom 0.254: v101.35,110.87 99.06,110.87 v99.06,110.11
N$2  (via drill 0.5 pad 0.25)
  Top 0.254: TRANSFORMER-.15 94.61,112.31 v94.61,110.24 | v97.54,110.11 97.65,110 C6.1
  Bottom 0.254: v94.61,110.24 94.74,110.11 v97.54,110.11
N$4  (via drill 0.25 pad 0.25)
  Top 0.254: U$2.45 105.44,89.25 v106.17,88.52 | RB1.2 107.79,88.68 v107.95,88.52
  Bottom 0.254: v106.17,88.52 v107.95,88.52
N$5  (via drill 0.25 pad 0.13)
  Top 0.254: TRANSFORMER-.16 93.64,112.58 R1.1 93.64,103 v97.54,103 | U$2.48 102.95,92 98.89,92 97.54,93.35 v97.54,95.13
  Bottom 0.254: v97.54,103 v97.54,95.13
N$7
  Top 0.254: RB2.2 106.93,87.49 106.93,88.9 106.08,89.75 | 106.08,89.75 U$2.46 | RB1.1 107.27,91.52 106.43,90.68 106.43,90.1 106.08,89.75
N$8  (via drill 0.25 pad 0.13)
  Top 0.254: 100.08,112.58 TRANSFORMER-.11 99.96,109.86 102.63,109.86 R49.1 102.63,106.07 102.11,105.54 v102.11,103 | U$2.42 100.08,87.75 v99.31,88.52
  Bottom 0.254: v102.11,103 99.31,100.21 v99.31,88.52
N$9  (via drill 0.25 pad 0.13)
  Top 0.254: TRANSFORMER-.9 104.43,112.58 R49.2 104.43,101.26 v104.39,101.22 | U$2.41 104.02,87.25 v104.27,87.51
  Bottom 0.254: v104.39,101.22 104.39,100.97 105.79,99.57 107.7,99.57 108.84,98.43 108.84,86.87 108.46,86.24 105.66,86.24 104.39,87.51 v104.27,87.51
N$42  (via drill 0.25 pad 0.13)
  Top 0.254: TRANSFORMER-.14 96.15,110.76 95.5,110.11 95.5,108.32 R1.2 95.5,108.2 v95.5,106.3 | U$2.47 98.34,90.25 v98.3,90.3
  Bottom 0.254: v95.5,106.3 95.5,90.3 v98.3,90.3
S1  (via drill 0.5 pad 0.13)
  Top 0.254: v68.33,16.13 69.6,16.13 71.12,17.66 85.85,17.66 87.38,19.18 87.38,32.13 96.27,41.02 96.27,78.11 102.95,78.11 U$2.25 | v56.64,16.13 55.77,15.26 DRAIN1:GATE1.2
  Bottom 0.254: v68.33,16.13 v56.64,16.13
S2  (via drill 0.5 pad 0.13)
  Top 0.254: U$2.23 94.36,79.75 94.36,43.56 84.33,33.53 v84.33,21.47 | v79.25,21.47 76.9,21.47 DRAIN2:GATE1.2
  Bottom 0.254: v84.33,21.47 v79.25,21.47
S3  (via drill 0.5 pad 0.13)
  Top 0.254: DRAIN3:GATE1.2 55.89,39.76 v60.2,44.07 | U$2.21 92.46,80.75 92.46,45.34 v86.61,45.34
  Bottom 0.254: v60.2,44.07 85.34,44.07 v86.61,45.34
S4  (via drill 0.5 pad 0.13)
  Top 0.254: U$2.19 90.42,81.75 90.42,51.18 84.33,51.18 v84.33,47.37 | v78.49,45.85 76.4,45.85 DRAIN4:GATE1.2
  Bottom 0.254: v78.49,45.85 82.8,45.85 v84.33,47.37
S5  (via drill 0.5 pad 0.13)
  Top 0.254: DRAIN5:GATE1.2 55.24,64.26 v58.17,67.19 | U$2.17 88.14,82.75 v88.14,73.03
  Bottom 0.254: v58.17,67.19 68.07,67.19 73.91,73.03 v88.14,73.03
S6  (via drill 0.5 pad 0.13)
  Top 0.254: U$2.15 82.04,83.75 v82.04,69.73 | v78.23,69.73 76.9,69.73 DRAIN6:GATE1.2
  Bottom 0.254: v82.04,69.73 v78.23,69.73
S7  (via drill 0.5 pad 0.13)
  Top 0.254: v58.17,89.28 53.42,89.28 DRAIN7:GATE1.2 | v71.63,94.36 71.88,94.36 80.01,86.24 80.01,84.75 U$2.13
  Bottom 0.254: v71.63,94.36 63.25,94.36 v58.17,89.28
S8  (via drill 0.5 pad 0.25)
  Top 0.254: U$2.11 86.11,85.75 v86.11,95.89 | DRAIN8:GATE1.2 78.87,95.76 v78.99,95.89
  Bottom 0.254: v78.99,95.89 v86.11,95.89
S9  (via drill 0.5 pad 0.25, 0.6)
  Top 0.254: U$2.9 89.53,86.75 v89.53,96.4 | DRAIN9:GATE1.2 55.12,115.26 v55.12,115.45
  Bottom 0.254: v89.53,96.4 89.53,97.28 71.25,97.28 64.39,104.14 45.47,104.14 45.47,115.45 v55.12,115.45
SENSE1
  Bottom 0.406: F1.R1 F1.R2 | F1.R2 58.74,23.5 | F1.R2 59,23.24 90.42,23.24 92.71,25.53 92.71,32.13 98.81,32.13 100.45,33.77 TEST_PORT.2
SENSE1_J
  Top 0.305: 98.16,7.13 DRAIN2:W1.1 98.04,3.69 35.56,3.69 30.99,8.26 30.99,14.1 36.15,19.26 49.02,19.26 | DRAIN1:PFET1.2 49.02,16.94 49.02,19.26 | 49.02,19.26 RC1.1
  Top 0.406: 98.16,7.13 98.16,10.93 96.01,13.07 96.01,24.89 98.16,27.04 98.16,27.06 TEST_PORT.4
SENSE2
  Top 0.406: DRAIN2:PFET1.2 73.83,24.76 74.17,24.76 | 74.17,24.76 RC2.1 | DRAIN3:W1.1 51.37,33.46 F2.R2 F2.R1 56.53,32.5 60.96,28.07 70.86,28.07 74.17,24.76
SENSE3
  Top 0.406: RC3.1 62.1,48.16 DRAIN4:W1.1 62.2,48.65 F3.R2 F3.R1 53.6,44.08 51.31,41.79 48.35,41.79 DRAIN3:PFET1.2
SENSE4
  Top 0.406: 73.06,50 DRAIN4:PFET1.2 | 73.06,50 74.08,51.01 RC4.1 | DRAIN5:W1.1 51.13,58.46 F4.R2 F4.R1 | F4.R1 56.41,58.53 | 73.06,50 70.1,52.96 59.31,52.96 56.41,55.86 F4.R1
SENSE5
  Top 0.406: RC5.1 62.45,67.66 DRAIN6:W1.1 62.45,73.53 F5.R2 F5.R1 53.34,73.4 53.34,69.22 50.56,66.44 DRAIN5:PFET1.2
SENSE6
  Top 0.406: 73.01,74.95 DRAIN6:PFET1.2 | 73.01,74.95 73.33,75.26 RC6.1 | DRAIN7:W1.1 51.37,83.96 F6.R2 F6.R1 56.4,81.91 59.94,78.36 69.6,78.36 73.01,74.95
SENSE7
  Top 0.406: RC7.1 62.2,92.86 DRAIN8:W1.1 62.2,98.41 F7.R2 F7.R1 53.34,94.11 51.17,91.94 DRAIN7:PFET1.2
SENSE8
  Top 0.406: 73.33,99.26 DRAIN8:PFET1.2 | RC8.1 73.33,99.26 | DRAIN9:W1.1 41.65,108.61 F8.R2 F8.R1 56.53,107.18 60.45,103.25 69.33,103.25 73.33,99.26
SENSE9
  Top 0.254: 24.38,107.03 28.92,107.03 40.89,118.75 49.02,118.75 49.02,117.44 | TO_TOP.P$2 TO_TOP.P$1 24.37,112.65 24.38,112.63 24.38,107.03 | 18.03,107.03 24.38,107.03 | 18.03,107.03 17.81,107.03 | GLV_CONTROL.4 7.65,101.89 12.79,107.03 18.03,107.03
  Top 0.406: RC9.1 RC10.1 67.8,123.91 F9.R2 F9.R1 53.34,123.65 53.34,119.51 51.27,117.44 49.02,117.44 DRAIN9:PFET1.2
SHUTDOWN_CIRCUIT
  Top 0.254: X6.P$2 7.64,92.91 GLV_CONTROL.1
  Top 0.406: X7.P$2 X6.P$2
SSR-
  Top 0.254: GLV_CONTROL.2 10.19,87.9 G1.1
SUPPLY  (via drill 0.25, 0.25 pad 0.13)
  Top 0.254: v101.35,79.12 99.06,79.12 97.54,80.65 97.54,91.95 96.52,91.95 v96.52,94.24 | v103.89,58.55 103.89,56.5 T1.2 | S1.2 93.21,101.25 SC1.1 96.52,101.25 v96.52,97.92
  Top 0.305: T1.2 T1.4
  Bottom 0.254: v101.35,79.12 101.35,71.76 103.38,69.73 103.38,59.06 v103.89,58.55 | v96.52,94.24 v96.52,97.92
SUPPLY_INTER  (via drill 0.25, 0.25 pad 0.13)
  Top 0.254: v92.71,97.03 93.02,97.03 | S1.1 93.21,97.03 93.02,97.03 | 93.02,97.03 S2.1 | GLV_CONTROL.3 12.24,103.25 v58.67,103.25
  Bottom 0.254: v58.67,103.25 61.47,103.25 68.58,96.14 74.42,96.14 75.82,94.75 91.44,94.75 91.44,97.03 v92.71,97.03
THERMISTOR1  (via drill 0.25 pad 0.25, 0.5 pad 0.25)  (1 unrouted)
  Top 0.254: R101.2 104.14,45.17 104.14,41.53 106.43,41.53 X5.P$2 | 104.39,45.17 100.08,45.17 v100.08,58.3 | U$2.27 100.08,80.25 v100.08,80.14
  Bottom 0.254: v100.08,58.3 v100.08,80.14
THERMISTOR2
  Top 0.254: X4.P$2 107.65,65.59 R102.2 107.7,68.31 107.7,79.38 106.32,80.75 U$2.28
THERMISTOR3
  Top 0.254: U$2.29 107.79,81.25 108.84,82.3 108.84,99.7 R103.2 108.73,102.26 X3.P$2
V+
  Top 0.254: 96.01,90.75 U$2.1 93.02,90.75 S2.2 94.88,93.35 SC2.1
V-  (via drill 0.25, 0.25 pad 0.13, 0.5 pad 0.13, 0.5 pad 0.25)
  Top 0.254: v97.28,39.25 97.03,39.25 89.41,31.63 89.41,19.94 | v99.06,43.56 99.06,58.7 C3.2 99.09,61.84 99.09,63.38 | 99.09,63.38 C2.2 99.05,65.06 C1.2 99.05,75.31 v106.68,75.31 | U$2.31 104.14,82.25 | U$2.30 104.14,81.75 104.14,82.25 | 104.14,88.25 U$2.43 | 104.14,88.25 105.16,88.25 v105.16,88.01 105.16,85.27 RB2.1 107.7,85.18 107.7,82.68 107.19,82.17 v106.68,82.17 | U$2.44 104.14,88.75 104.14,88.25 | X4.P$1 106.41,61.85 104.14,61.85 102.62,63.38 99.09,63.38 | 106.68,82.25 v106.68,82.17 | 104.14,82.25 106.51,82.25 arc90 v106.68,82.17 | 98.55,107.03 C7.2 100.58,107.02 v100.58,105.41 | 98.55,107.03 97.65,107.03 C6.2 | SC2.2 94.88,96.27 | 94.88,96.27 94.88,99.45 SC1.2 | 98.56,96.27 94.88,96.27 | 98.56,96.27 98.55,96.28 98.55,107.03 | v105.66,91.06 104.01,92.71 99.31,92.71 98.56,93.47 98.56,96.27
  Top 0.406: DRAIN1:W1.1 51.36,8.46 F0.R2 F0.R1 56.4,13.09 57.79,14.48 | 57.79,14.48 RC0.1 | 57.79,14.48 58.84,13.43 CR0.2 82.9,13.43 89.41,19.94 89.41,22.51 TEST_PORT.3
  Bottom 0.254: v99.06,43.56 99.06,41.02 v97.28,39.25 97.28,39.01 X5.P$1 | v106.68,75.31 v106.68,82.17 | v105.66,91.06 104.65,90.05 104.65,88.52 v105.16,88.01 | X3.P$1 101.24,104.76 v100.58,105.41
VREF1  (via drill 0.25 pad 0.13)
  Top 0.254: C2.1 100.89,66.62 v100.84,66.68 | v100.71,77.09 v98.3,77.09 | v99.82,84.46 101.35,84.46 101.55,84.25 U$2.35
  Bottom 0.254: v100.84,66.68 100.84,76.97 v100.71,77.09 | v98.3,77.09 98.3,80.9 99.82,82.68 v99.82,84.46
VREF2  (via drill 0.25, 0.25 pad 0.13)
  Top 0.254: v98.55,83.7 98.61,83.75 U$2.34 105.61,83.75 v105.66,83.7 | v105.66,69.98 105.66,68.45 R102.1 105.78,68.33 C1.1 | R101.1 107.45,48.4 108.97,49.91 v108.97,69.98 | R103.1 106.93,98.56 v107.7,97.79
  Bottom 0.254: v98.55,83.7 98.55,85.22 107.7,94.36 v107.7,97.79 | v105.66,83.7 v105.66,69.98 v108.97,69.98
VREG  (via drill 0.25 pad 0.13)
  Top 0.254: 102.11,56.61 T1.3 101.79,60.88 C3.1 101.34,61.84 v101.85,62.36 | v102.36,69.47 102.36,70.74 v104.9,73.28 | U$2.40 104.13,86.75 104.39,86.49 104.39,85.22 | 104.39,85.22 104.39,84.71 v104.65,84.71 104.61,84.75 U$2.36 | 104.39,85.22 104.36,85.25 U$2.37
  Bottom 0.254: v101.85,62.36 101.85,68.96 v102.36,69.47 | v104.9,73.28 104.9,84.46 v104.65,84.71

### Text on the board
tDocu: hytech_2017_bms_segment_lower_rev0 | GLV | TS | Danger High Voltage
bDocu: GLV | TS | Danger High Voltage